# Altium schematic sheet PCB.SchDoc
size A4 portrait
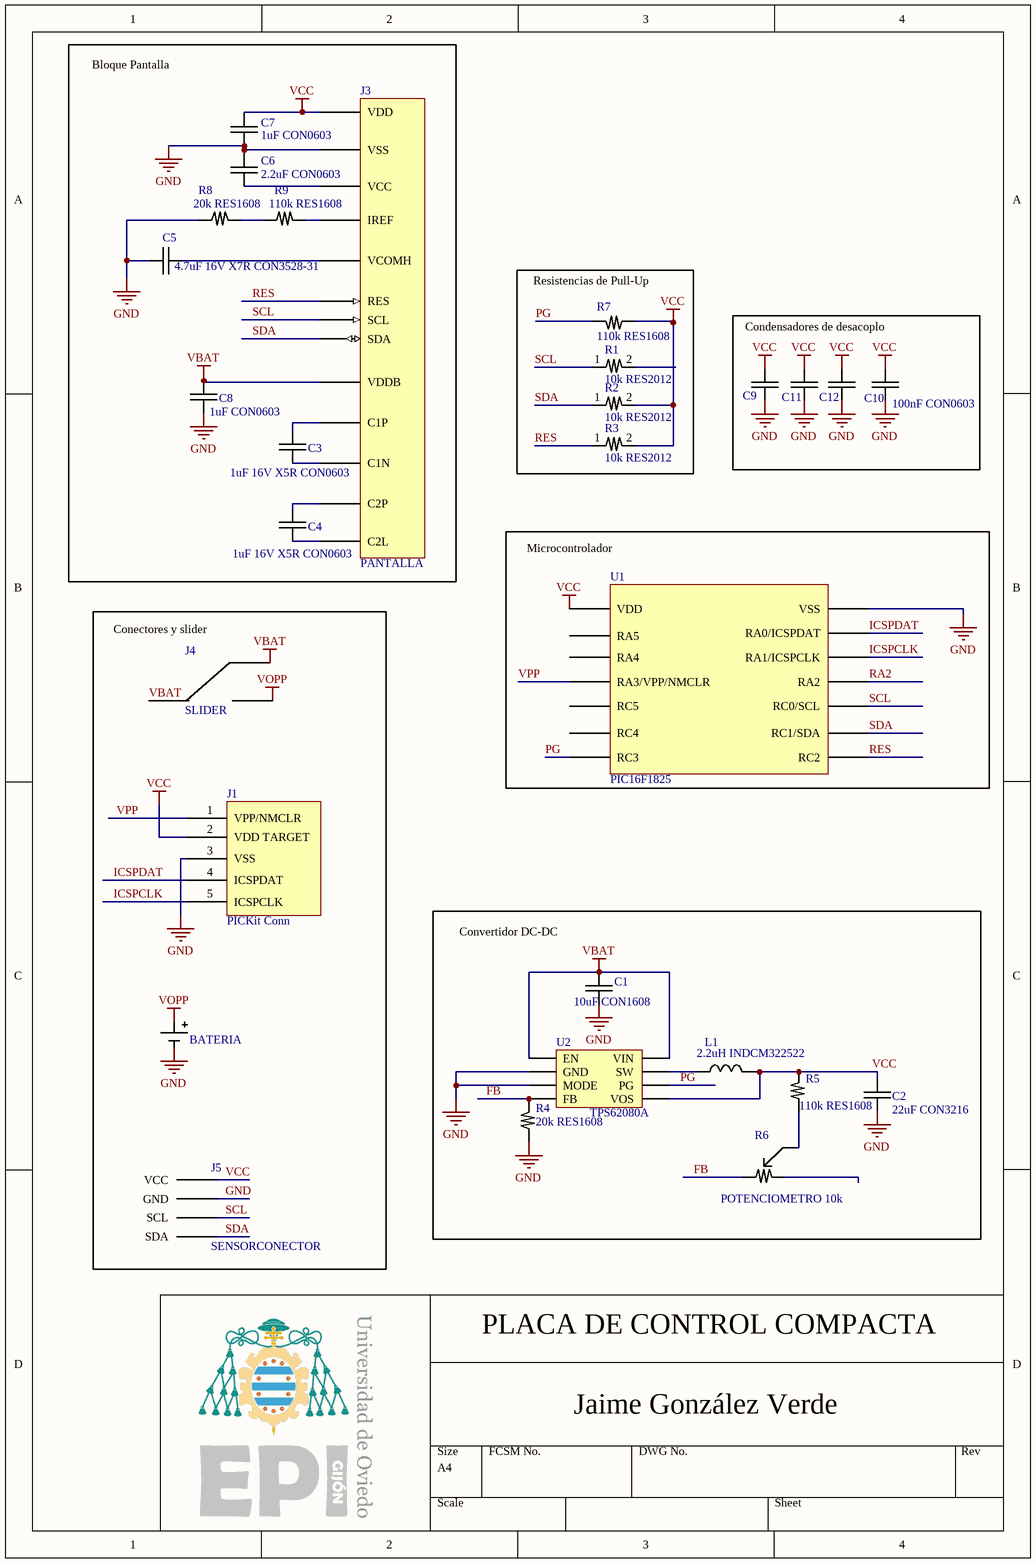
[diagram p0: PCB.SchDoc]

## Parts
?  BATERIA  [BATERIA]
C1  10uF CON1608  [CAPC1608X06N]
C2  22uF CON3216  [CAPC3216X06N]
C3  1uF 16V X5R CON0603  [CAPC0603X06N]
C4  1uF 16V X5R CON0603  [CAPC0603X06N]
C5  4.7uF 16V X7R CON3528-31  [CAPC3524X06N]
C6  2.2uF CON0603  [CAPC0603X06N]
C7  1uF CON0603  [CAPC0603X06N]
C8  1uF CON0603  [CAPC0603X06N]
C9  100nFCON0603  [CAPC0603X06N]  (value not drawn)
C10  100nF CON0603  [CAPC0603X06N]
C11  (no value)  [CAPC0603X06N]
C12  100nF CON0603  [CAPC0603X06N]  (value not drawn)
J1  PICKit Conn  [PICKIT3 CONN]
J3  PANTALLA  [PANTALLA]
J4  SLIDER  [JS102011SAQN]
J5  SENSORCONECTOR  [ConectorSMD1,3mm]
L1  2.2uH INDCM322522  [INDC3225X06N]
R1  10k RES2012  [RESC2012X06N]
R2  10k RES2012  [RESC2012X06N]
R3  10k RES2012  [RESC2012X06N]
R4  20k RES1608  [RESC1608X06N]
R5  110k RES1608  [RESC1608X06N]
R6  POTENCIOMETRO 10k  [POTENCIOMETRO]
R7  110k RES1608  [RESC1608X06N]
R8  20k RES1608  [RESC1608X06N]
R9  110k RES1608  [RESC1608X06N]
U1  PIC16F1825  [PIC16(L)F1825 QFN]
U2  TPS62080A  [TPS62080]

## Blocks framed on the sheet
Bloque Pantalla: C3-C8 J3 R8 R9
Resistencias de Pull-Up: R1-R3 R7
Condensadores de desacoplo: C9-C12
Microcontrolador: U1
Conectores y slider: ? J1 J4 J5
Convertidor DC-DC: C1 C2 L1 R4-R6 U2

## Nets
GND: ?.1 C1.1 C2.1 C5.1 C6.2 C7.2 C8.2 C9.1 C10.1 C11.1 C12.1 J1.3(VSS) J3.7(VSS) J5.2(GND) R4.1 R8.1 U1.13(VSS) U2.2(GND) U2.3(MODE)
VBAT: C1.2 C8.1 J3.5(VDDB) J4.0 J4.1 U2.1(EN) U2.8(VIN)
VCC: C2.2 C7.1 C9.2 C10.2 C11.2 C12.2 J1.2(VDD_TARGET) J3.8(VDD) J5.3(VCC) L1.2 R2.2 R3.2 R5.2 R7.1 U1.16(VDD) U2.5(VOS)
VOPP: ?.0 J4.2
FB: R4.2 R6.0 U2.4(FB)
ICSPCLK: J1.5(ICSPCLK) U1.11(RA1/ICSPCLK)
ICSPDAT: J1.4(ICSPDAT) U1.12(RA0/ICSPDAT)
PG: R7.2 U1.6(RC3) U2.6(PG)
RA2: U1.10(RA2)
RES: J3.9(RES) R3.1 U1.7(RC2)
SCL: J3.10(SCL) J5.1(SCL) R1.1 U1.9(RC0/SCL)
SDA: J3.11(SDA) J5.0(SDA) R2.1 U1.8(RC1/SDA)
VPP: J1.1(VPP/NMCLR) U1.3(RA3/VPP/NMCLR)
NetC3_1: C3.1 J3.3(C1P)
NetC3_2: C3.2 J3.4(C1N)
NetC4_1: C4.1 J3.1(C2P)
NetC4_2: C4.2 J3.2(C2L)
NetC5_2: C5.2 J3.13(VCOMH)
NetC6_1: C6.1 J3.14(VCC)
NetJ3_12: J3.12(IREF) R9.2
NetL1_1: L1.1 U2.7(SW)
NetR5_1: R5.1 R6.2
NetR8_2: R8.2 R9.1

Not connected (* = marked no-connect by the designer): R1 2; R6 1; U1 1(RA5) 2(RA4) 4(RC5) 5(RC4)

## Notes on the sheet
- PLACA DE CONTROL COMPACTA
- Jaime González Verde

## Library data of the parts
C1 = CON1608
C2 = CON3216
C3 C4 C6-C12 = CON0603
C5 = CON3528-31
L1 = INDCM322522
R1-R3 = RES2012
R4 R5 R7-R9 = RES1608
R6 = POTENCIOMETRO